# Altium project IN-14辉光钟.PrjPcb
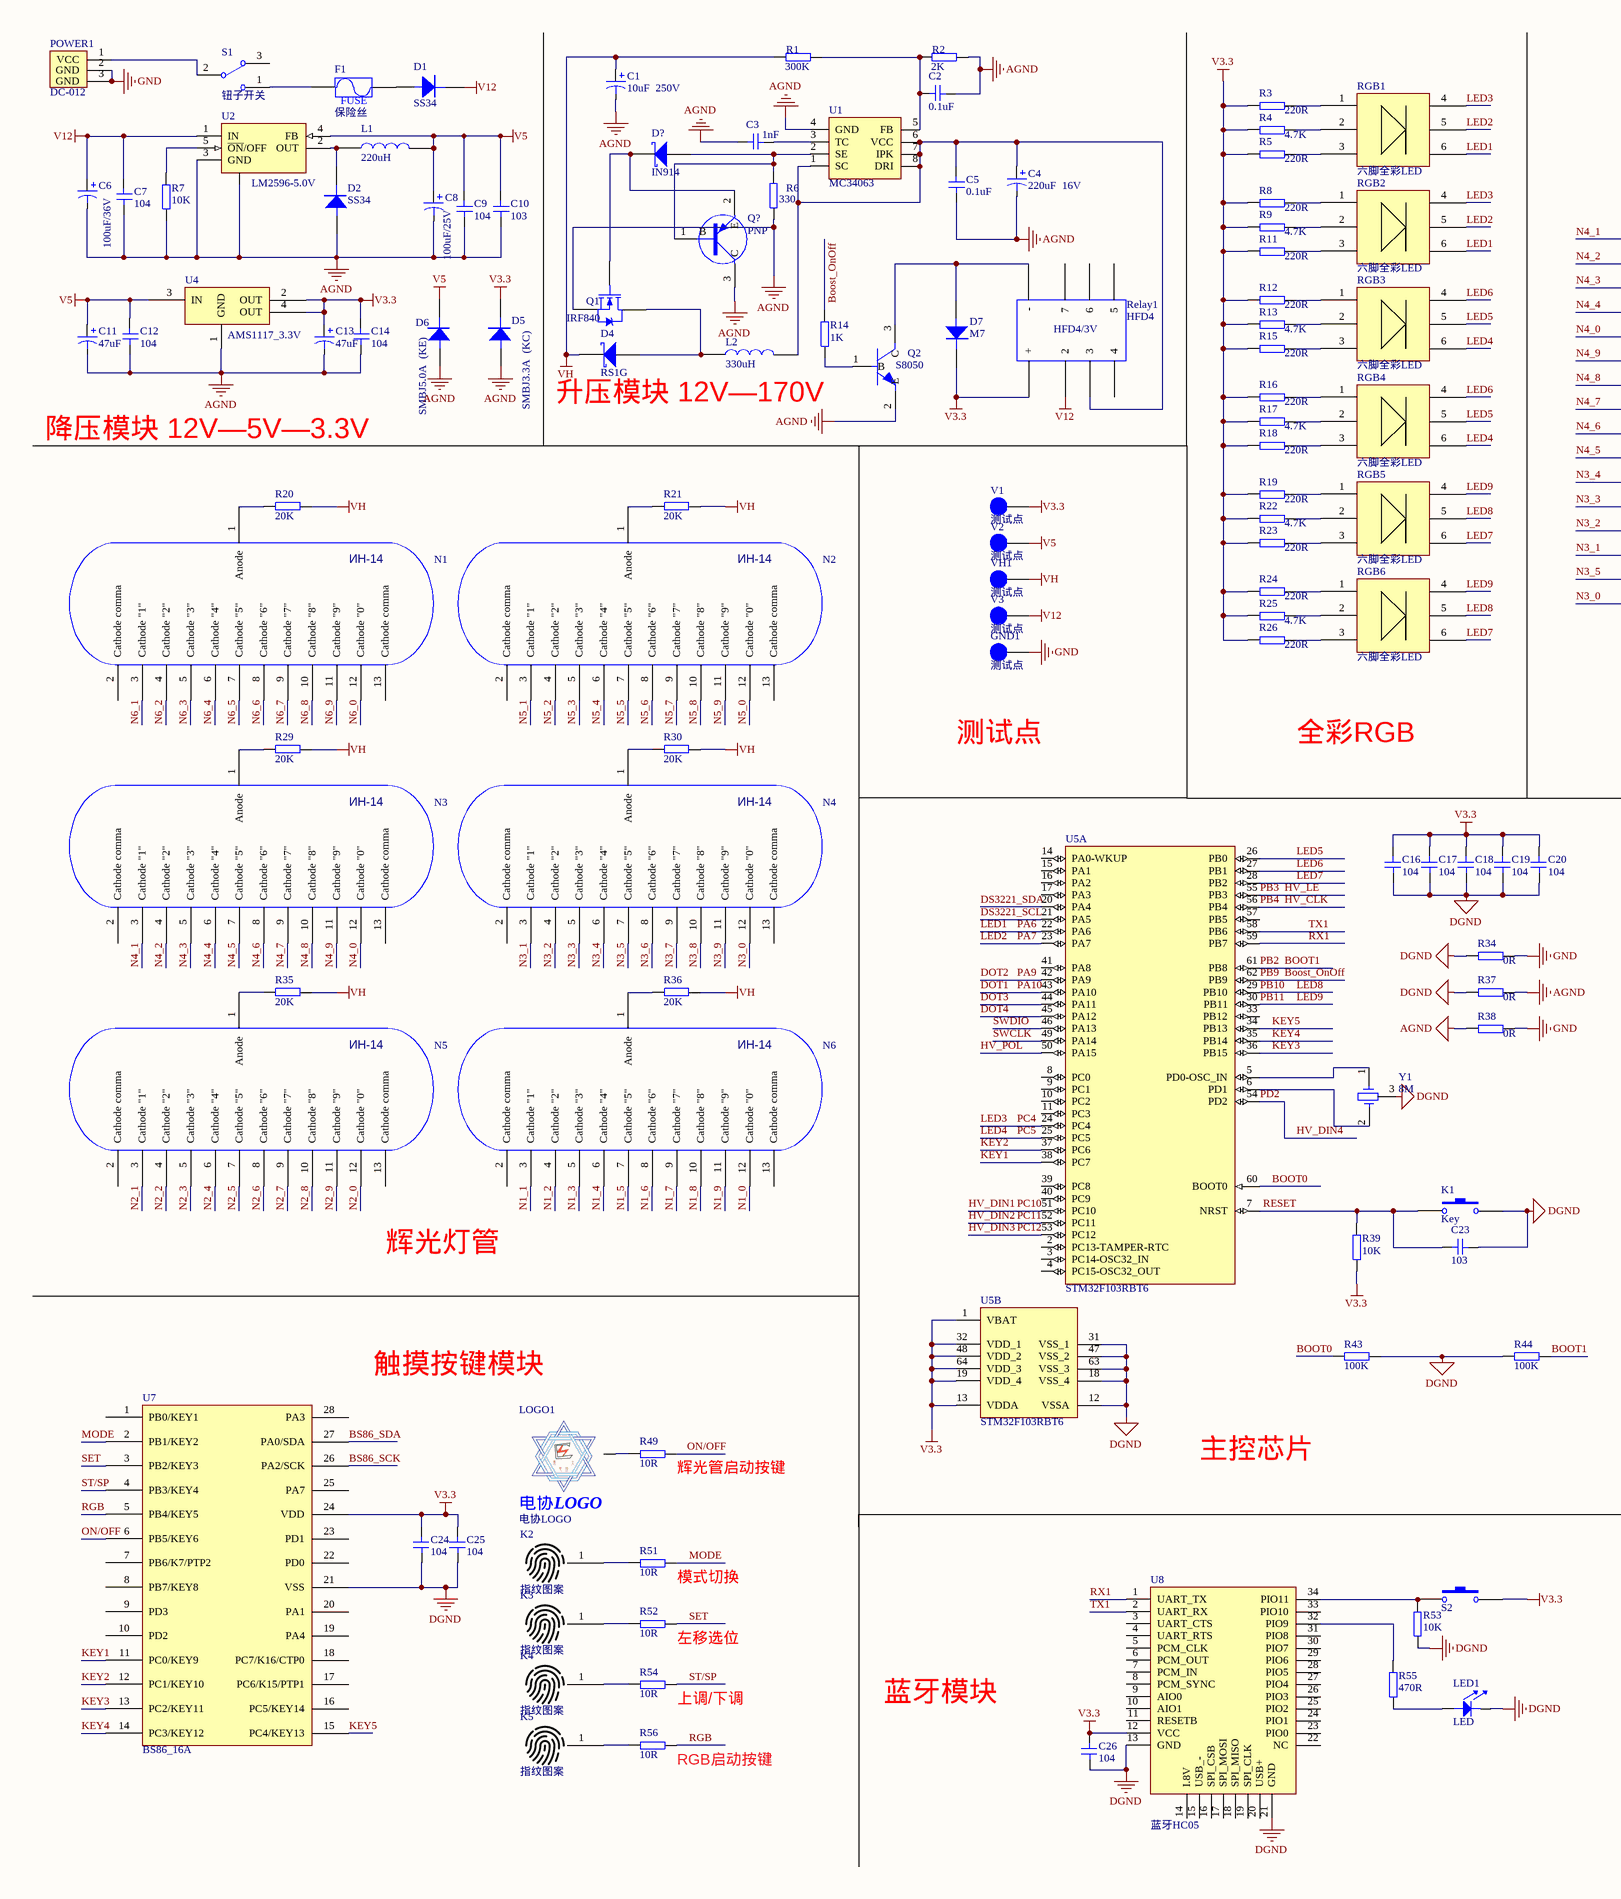
[diagram p0: IN-14辉光钟_Sheet.SchDoc, left]
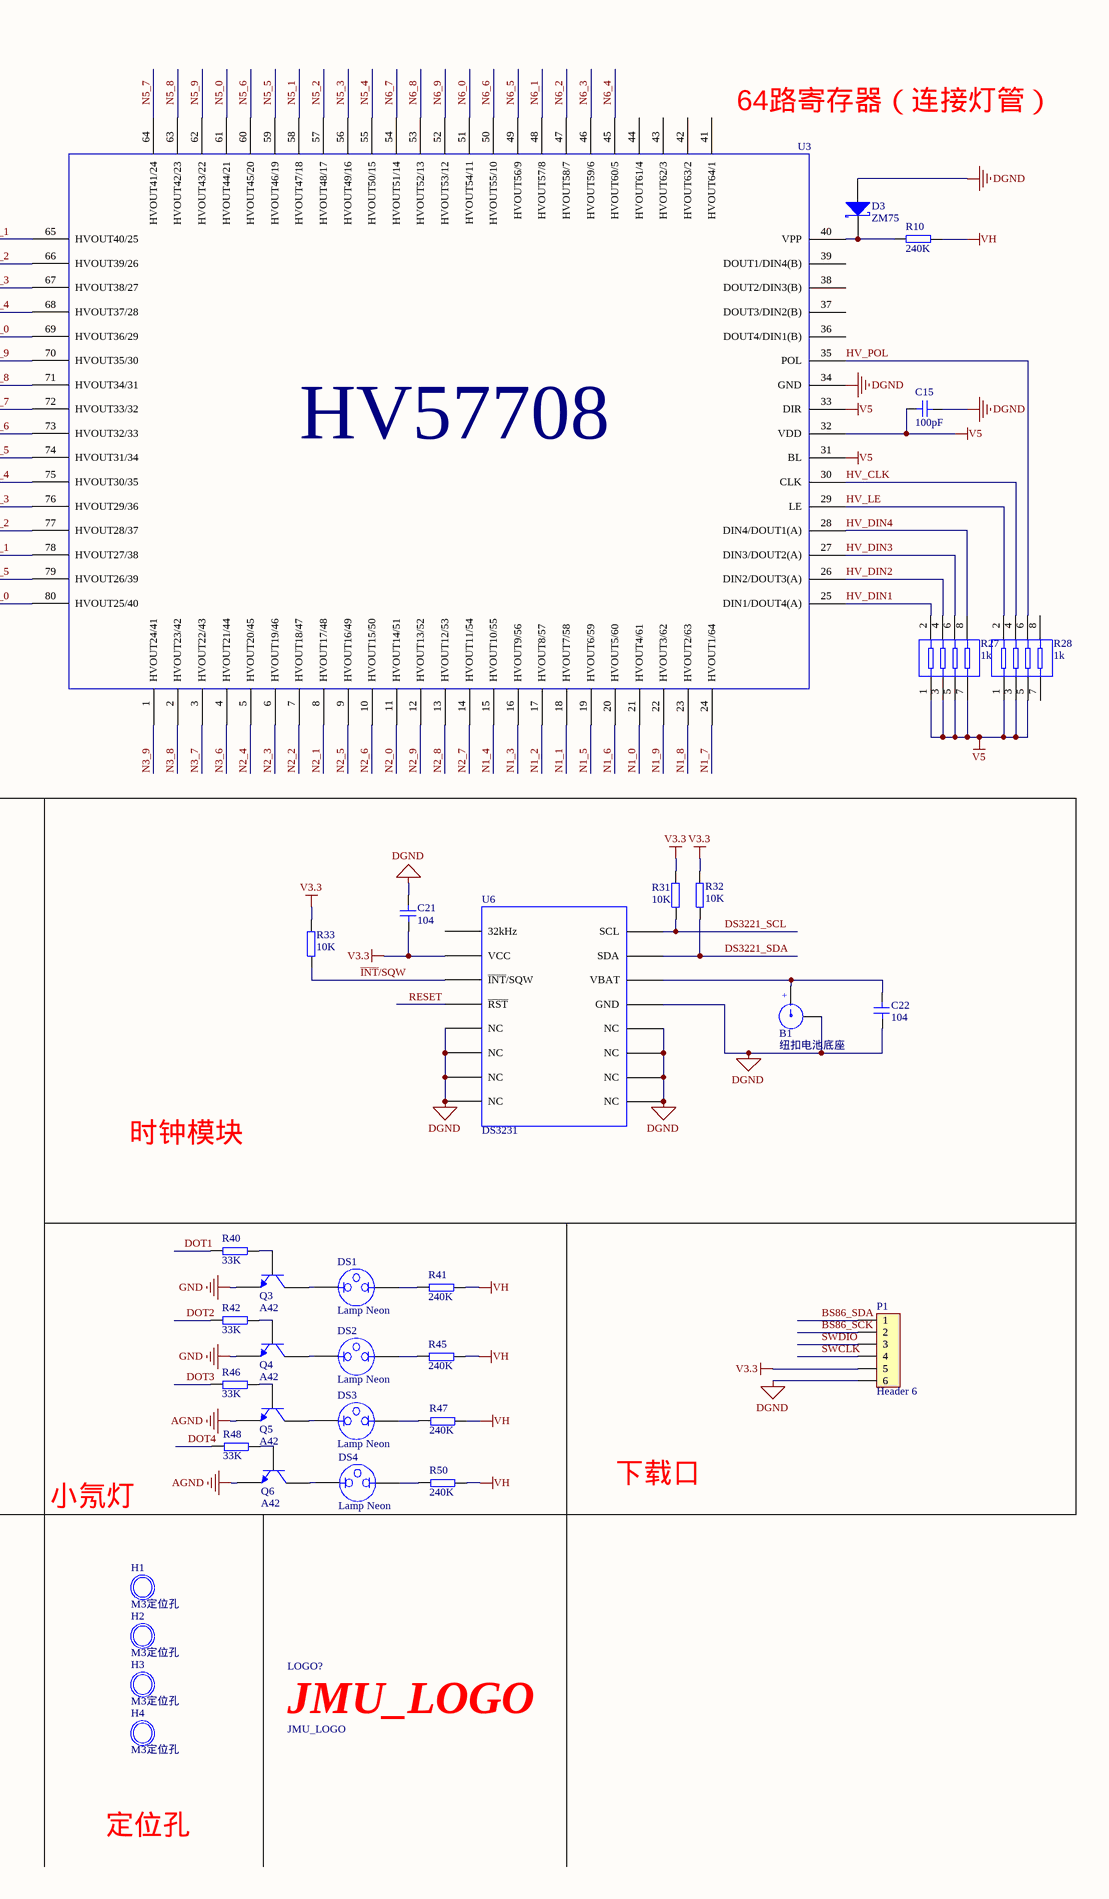
[diagram p1: IN-14辉光钟_Sheet.SchDoc, right]
1 sheet, 148 parts. Net scope: global (net labels, ports and power ports of the same name join across sheets).
Board file: IN-14辉光钟_PCB.PcbDoc

## Sheet IN-14辉光钟_Sheet.SchDoc
size A2

### Parts
B1  纽扣电池底座  [CR1220]
C1  10uF  250V  [RB.2.4]
C2  0.1uF  [0805C]
C3  1nF  [0805C]
C4  220uF  16V  [RB.1.2]
C5  0.1uF  [0805C]
C6  100uF/36V  [TAJ-D]
C7  104  [0805C]
C8  100uF/25V  [TAJ-D]
C9  104  [0805C]
C10  103  [0805C]
C11  47uF  [TAJ-A]
C12  104  [0805C]
C13  47uF  [TAJ-A]
C14  104  [0805C]
C15  100pF  [0805C]
C16  104  [0805C]
C17  104  [0805C]
C18  104  [0805C]
C19  104  [0805C]
C20  104  [0805C]
C21  104  [0805C]
C22  104  [0805C]
C23  103  [0805C]
C24  104  [0805C]
C25  104  [0805C]
C26  104  [0805C]
D1  SS34  [SMA/DO-214AC]
D2  SS34  [SMA/DO-214AC]
D3  ZM75  [LL-34]
D4  RS1G  [SMB]
D5  SMBJ3.3A  (KC)  [SMBJ]
D6  SMBJ5.0A  (KE)  [SMBJ]
D7  M7  [SMA/DO-214AC]
D?  IN914  [LL-34]
DS1  Lamp Neon  [PIN2]
DS2  Lamp Neon  [PIN2]
DS3  Lamp Neon  [PIN2]
DS4  Lamp Neon  [PIN2]
F1  保险丝  [1812]
GND1  测试点  [HEADER 1]
H1  M3定位孔  [定位孔]
H2  M3定位孔  [定位孔]
H3  M3定位孔  [定位孔]
H4  M3定位孔  [定位孔]
K1  Key  [贴片按键]
K2  指纹图案  [指纹图案]
K3  指纹图案  [指纹图案]
K4  指纹图案  [指纹图案]
K5  指纹图案  [指纹图案]
L1  220uH  [电感 220uh]
L2  330uH  [电感 220uH(大)]
LED1  LED  [0805LED(RED)]
LOGO1  电协LOGO  [电协LOGO]
LOGO?  JMU_LOGO  [JMU_LOGO(1.35cm)]
N1  ИН-14  [IN14]  (value not drawn)
N2  ИН-14  [IN14]  (value not drawn)
N3  ИН-14  [IN14]  (value not drawn)
N4  ИН-14  [IN14]  (value not drawn)
N5  ИН-14  [IN14]  (value not drawn)
N6  ИН-14  [IN14]  (value not drawn)
P1  Header 6  [Header 6]
POWER1  DC-012  [DC-005]
Q1  IRF840  [TO-263-2L]
Q2  S8050  [SOT-23]
Q3  A42  [SOT-23-3L]
Q4  A42  [SOT-23-3L]
Q5  A42  [SOT-23-3L]
Q6  A42  [SOT-23-3L]
Q?  PNP  [TO-92]
R1  300K  [0805R]
R2  2K  [0805R]
R3  220R  [0805R]
R4  4.7K  [0805R]
R5  220R  [0805R]
R6  330  [0805R]
R7  10K  [0805R]
R8  220R  [0805R]
R9  4.7K  [0805R]
R10  240K  [0805R]
R11  220R  [0805R]
R12  220R  [0805R]
R13  4.7K  [0805R]
R14  1K  [0805R]
R15  220R  [0805R]
R16  220R  [0805R]
R17  4.7K  [0805R]
R18  220R  [0805R]
R19  220R  [0805R]
R20  20K  [0805R]
R21  20K  [0805R]
R22  4.7K  [0805R]
R23  220R  [0805R]
R24  220R  [0805R]
R25  4.7K  [0805R]
R26  220R  [0805R]
R27  1k  [排阻(4位贴片)]
R28  1k  [排阻(4位贴片)]
R29  20K  [0805R]
R30  20K  [0805R]
R31  10K  [0805R]
R32  10K  [0805R]
R33  10K  [0805R]
R34  0R  [0805R]
R35  20K  [0805R]
R36  20K  [0805R]
R37  0R  [0805R]
R38  0R  [0805R]
R39  10K  [0805R]
R40  33K  [0805R]
R41  240K  [0805R]
R42  33K  [0805R]
R43  100K  [0805R]
R44  100K  [0805R]
R45  240K  [0805R]
R46  33K  [0805R]
R47  240K  [0805R]
R48  33K  [0805R]
R49  10R  [0805R]
R50  240K  [0805R]
R51  10R  [0805R]
R52  10R  [0805R]
R53  10K  [0805R]
R54  10R  [0805R]
R55  470R  [0805R]
R56  10R  [0805R]
Relay1  HFD4  [HFD4]
RGB1  六脚全彩LED  [全彩LED]
RGB2  六脚全彩LED  [全彩LED]
RGB3  六脚全彩LED  [全彩LED]
RGB4  六脚全彩LED  [全彩LED]
RGB5  六脚全彩LED  [全彩LED]
RGB6  六脚全彩LED  [全彩LED]
S1  钮子开关  [钮子开关（大）]
S2  SW-PB  [贴片按键（红头）]  (value not drawn)
U1  MC34063  [SOW-8]
U2  LM2596-5.0V  [TO-263-5]
U3  HV57708  [HV57708PG]  (value not drawn)
U4  AMS1117_3.3V  [SOT-223]
U5  STM32F103RBT6  [LQFP64_N]  (parts A,B of 2)
U6  DS3231  [SOP16_75MM]
U7  BS86_16A  [LC-SOP-28_300mil]
U8  蓝牙HC05  [蓝牙HC05]
V1  测试点  [HEADER 1]
V2  测试点  [HEADER 1]
V3  测试点  [HEADER 1]
VH1  测试点  [HEADER 1]
Y1  8M  [三脚贴片8M晶振]

### Nets
AGND: C1.2 C2.1 C3.2 C4.2 C5.1 C6.2 C7.1 C8.2 C9.1 C10.1 C11.2 C12.1 C13.2 C14.1 D2.1 D5.1 D6.1 Q1.3(S) Q2.2(E) Q5.2(E) Q6.2(E) Q?.3(C) R2.2 R6.1 R7.1 R37.2 R38.1 U1.4(GND) U2.3(GND) U2.6 U4.1(GND)
DGND: B1.2 C15.1 C16.2 C17.2 C18.2 C19.2 C20.2 C21.1 C22.2 C23.1 C24.2 C25.2 C26.2 D3.1(A) K1.2 LED1.2 P1.6 R34.1 R37.1 R43.1 R44.2 R53.1 U3.34(GND) U5.12(VSSA) U5.18(VSS_4) U5.31(VSS_1) U5.47(VSS_2) U5.63(VSS_3) U6.5(NC) U6.6(NC) U6.7(NC) U6.8(NC) U6.9(NC) U6.10(NC) U6.11(NC) U6.12(NC) U6.13(GND) U7.21(VSS) U8.13(GND) U8.21(GND) Y1.3
GND: GND1.1 POWER1.2(GND) POWER1.3(GND) Q3.2(E) Q4.2(E) R34.2 R38.2
V3.3: C13.1 C14.2 C16.1 C17.1 C18.1 C19.1 C20.1 C21.2 C24.1 C25.1 C26.1 D5.2 D7.2 P1.5 R3.1 R4.1 R5.1 R8.1 R9.1 R11.1 R12.1 R13.1 R15.1 R16.1 R17.1 R18.1 R19.1 R22.1 R23.1 R24.1 R25.1 R26.1 R31.2 R32.2 R33.2 R39.1 Relay1.1(+) S2.2 U4.2(OUT) U4.4(OUT) U5.1(VBAT) U5.13(VDDA) U5.19(VDD_4) U5.32(VDD_1) U5.48(VDD_2) U5.64(VDD_3) U6.2(VCC) U7.24(VDD) U8.12(VCC) V1.1
V5: C8.1 C9.2 C10.2 C11.1 C12.2 C15.2 D6.2 L1.2 R27.1 R27.3 R27.5 R27.7 R28.1 R28.3 R28.5 U2.4(FB) U3.31(BL) U3.32(VDD) U3.33(DIR) U4.3(IN) V2.1
V12: C6.1 C7.2 D1.2 Relay1.2 U2.1(IN) V3.1
VH: C1.1 D4.2(K) R1.1 R10.1 R20.1 R21.1 R29.1 R30.1 R35.1 R36.1 R41.2 R45.2 R47.2 R50.2 VH1.1
Boost_OnOff: R14.2 U5.62(PB9)  [also labelled PB9]
BOOT0: R43.2 U5.60(BOOT0)
BOOT1: R44.1 U5.61(PB8)  [also labelled PB2]
BS86_SCK: P1.2 U7.26(PA2/SCK)
BS86_SDA: P1.1 U7.27(PA0/SDA)
DOT1: R40.1 U5.43(PA10)  [also labelled PA10]
DOT2: R42.1 U5.42(PA9)  [also labelled PA9]
DOT3: R46.1 U5.44(PA11)
DOT4: R48.1 U5.45(PA12)
DS3221_SCL: R31.1 U5.21(PA5) U6.16(SCL)
DS3221_SDA: R32.1 U5.20(PA4) U6.15(SDA)
HV_CLK: R28.4 U3.30(CLK) U5.56(PB4)  [also labelled PB4]
HV_DIN1: R27.2 U3.25(DIN1/DOUT4(A)) U5.51(PC10)  [also labelled PC10]
HV_DIN2: R27.4 U3.26(DIN2/DOUT3(A)) U5.52(PC11)  [also labelled PC11]
HV_DIN3: R27.6 U3.27(DIN3/DOUT2(A)) U5.53(PC12)  [also labelled PC12]
HV_DIN4: R27.8 U3.28(DIN4/DOUT1(A)) U5.54(PD2)  [also labelled PD2]
HV_LE: R28.2 U3.29(LE) U5.55(PB3)  [also labelled PB3]
HV_POL: R28.6 U3.35(POL) U5.50(PA15)
~{INT}/SQW: R33.1 U6.3(~{INT}/SQW)
KEY1: U5.38(PC7) U7.11(PC0/KEY9)
KEY2: U5.37(PC6) U7.12(PC1/KEY10)
KEY3: U5.36(PB15) U7.13(PC2/KEY11)
KEY4: U5.35(PB14) U7.14(PC3/KEY12)
KEY5: U5.34(PB13) U7.15(PC4/KEY13)
LED1: RGB1.6 RGB2.6 U5.22(PA6)  [also labelled PA6]
LED2: RGB1.5 RGB2.5 U5.23(PA7)  [also labelled PA7]
LED3: RGB1.4 RGB2.4 U5.24(PC4)  [also labelled PC4]
LED4: RGB3.6 RGB4.6 U5.25(PC5)  [also labelled PC5]
LED5: RGB3.5 RGB4.5 U5.26(PB0)
LED6: RGB3.4 RGB4.4 U5.27(PB1)
LED7: RGB5.6 RGB6.6 U5.28(PB2)
LED8: RGB5.5 RGB6.5 U5.29(PB10)  [also labelled PB10]
LED9: RGB5.4 RGB6.4 U5.30(PB11)  [also labelled PB11]
MODE: R51.2 U7.2(PB1/KEY2)
N1_0: N6.12(Cathode_"0") U3.21(HVOUT4/61)
N1_1: N6.3(Cathode_"1") U3.18(HVOUT7/58)
N1_2: N6.4(Cathode_"2") U3.17(HVOUT8/57)
N1_3: N6.5(Cathode_"3") U3.16(HVOUT9/56)
N1_4: N6.6(Cathode_"4") U3.15(HVOUT10/55)
N1_5: N6.7(Cathode_"5") U3.19(HVOUT6/59)
N1_6: N6.8(Cathode_"6") U3.20(HVOUT5/60)
N1_7: N6.9(Cathode_"7") U3.24(HVOUT1/64)
N1_8: N6.10(Cathode_"8") U3.23(HVOUT2/63)
N1_9: N6.11(Cathode_"9") U3.22(HVOUT3/62)
N2_0: N5.12(Cathode_"0") U3.11(HVOUT14/51)
N2_1: N5.3(Cathode_"1") U3.8(HVOUT17/48)
N2_2: N5.4(Cathode_"2") U3.7(HVOUT18/47)
N2_3: N5.5(Cathode_"3") U3.6(HVOUT19/46)
N2_4: N5.6(Cathode_"4") U3.5(HVOUT20/45)
N2_5: N5.7(Cathode_"5") U3.9(HVOUT16/49)
N2_6: N5.8(Cathode_"6") U3.10(HVOUT15/50)
N2_7: N5.9(Cathode_"7") U3.14(HVOUT11/54)
N2_8: N5.10(Cathode_"8") U3.13(HVOUT12/53)
N2_9: N5.11(Cathode_"9") U3.12(HVOUT13/52)
N3_0: N4.12(Cathode_"0") U3.80(HVOUT25/40)
N3_1: N4.3(Cathode_"1") U3.78(HVOUT27/38)
N3_2: N4.4(Cathode_"2") U3.77(HVOUT28/37)
N3_3: N4.5(Cathode_"3") U3.76(HVOUT29/36)
N3_4: N4.6(Cathode_"4") U3.75(HVOUT30/35)
N3_5: N4.7(Cathode_"5") U3.79(HVOUT26/39)
N3_6: N4.8(Cathode_"6") U3.4(HVOUT21/44)
N3_7: N4.9(Cathode_"7") U3.3(HVOUT22/43)
N3_8: N4.10(Cathode_"8") U3.2(HVOUT23/42)
N3_9: N4.11(Cathode_"9") U3.1(HVOUT24/41)
N4_0: N3.12(Cathode_"0") U3.69(HVOUT36/29)
N4_1: N3.3(Cathode_"1") U3.65(HVOUT40/25)
N4_2: N3.4(Cathode_"2") U3.66(HVOUT39/26)
N4_3: N3.5(Cathode_"3") U3.67(HVOUT38/27)
N4_4: N3.6(Cathode_"4") U3.68(HVOUT37/28)
N4_5: N3.7(Cathode_"5") U3.74(HVOUT31/34)
N4_6: N3.8(Cathode_"6") U3.73(HVOUT32/33)
N4_7: N3.9(Cathode_"7") U3.72(HVOUT33/32)
N4_8: N3.10(Cathode_"8") U3.71(HVOUT34/31)
N4_9: N3.11(Cathode_"9") U3.70(HVOUT35/30)
N5_0: N2.12(Cathode_"0") U3.61(HVOUT44/21)
N5_1: N2.3(Cathode_"1") U3.58(HVOUT47/18)
N5_2: N2.4(Cathode_"2") U3.57(HVOUT48/17)
N5_3: N2.5(Cathode_"3") U3.56(HVOUT49/16)
N5_4: N2.6(Cathode_"4") U3.55(HVOUT50/15)
N5_5: N2.7(Cathode_"5") U3.59(HVOUT46/19)
N5_6: N2.8(Cathode_"6") U3.60(HVOUT45/20)
N5_7: N2.9(Cathode_"7") U3.64(HVOUT41/24)
N5_8: N2.10(Cathode_"8") U3.63(HVOUT42/23)
N5_9: N2.11(Cathode_"9") U3.62(HVOUT43/22)
N6_0: N1.12(Cathode_"0") U3.51(HVOUT54/11)
N6_1: N1.3(Cathode_"1") U3.48(HVOUT57/8)
N6_2: N1.4(Cathode_"2") U3.47(HVOUT58/7)
N6_3: N1.5(Cathode_"3") U3.46(HVOUT59/6)
N6_4: N1.6(Cathode_"4") U3.45(HVOUT60/5)
N6_5: N1.7(Cathode_"5") U3.49(HVOUT56/9)
N6_6: N1.8(Cathode_"6") U3.50(HVOUT55/10)
N6_7: N1.9(Cathode_"7") U3.54(HVOUT51/14)
N6_8: N1.10(Cathode_"8") U3.53(HVOUT52/13)
N6_9: N1.11(Cathode_"9") U3.52(HVOUT53/12)
ON/OFF: R49.2 U7.6(PB5/KEY6)
RESET: C23.2 K1.1 R39.2 U5.7(NRST) U6.4(~{RST})
RGB: R56.2 U7.5(PB4/KEY5)
RX1: U5.59(PB7) U8.1(UART_TX)
SET: R52.2 U7.3(PB2/KEY3)
ST/SP: R54.2 U7.4(PB3/KEY4)
SWCLK: P1.4 U5.49(PA14)
SWDIO: P1.3 U5.46(PA13)
TX1: U5.58(PB6) U8.2(UART_RX)
NetB1_1: B1.1(+) C22.1 U6.14(VBAT)
NetC2_2: C2.2 R1.2 R2.1 U1.5(FB)
NetC3_1: C3.1 U1.3(TC)
NetC4_1: C4.1 C5.2 L2.2 Relay1.3 U1.1(SC) U1.6(VCC) U1.7(IPK) U1.8(DRI)
NetD1_1: D1.1 F1.2
NetD2_2: D2.2 L1.1 U2.2(OUT)
NetD3_2: D3.2(K) R10.2 U3.40(VPP)
NetD4_1: D4.1(A) L2.1 Q1.2(D)
NetD7_1: D7.1 Q2.3(C) Relay1.8(-)
NetD?_1: D?.1(A) Q?.1(B) R6.2 U1.2(SE)
NetD?_2: D?.2(K) Q1.1(G) Q?.2(E)
NetDS1_1: DS1.1 Q3.3(C)
NetDS1_2: DS1.2 R41.1
NetDS2_1: DS2.1 Q4.3(C)
NetDS2_2: DS2.2 R45.1
NetDS3_1: DS3.1 Q5.3(C)
NetDS3_2: DS3.2 R47.1
NetDS4_1: DS4.1 Q6.3(C)
NetDS4_2: DS4.2 R50.1
NetF1_1: F1.1 S1.1
NetK2_1: K2.1 R51.1
NetK3_1: K3.1 R52.1
NetK4_1: K4.1 R54.1
NetK5_1: K5.1 R56.1
NetLED1_1: LED1.1 R55.1
NetLOGO1_1: LOGO1.1 R49.1
NetN1_1: N1.1(Anode) R20.2
NetN2_1: N2.1(Anode) R21.2
NetN3_1: N3.1(Anode) R29.2
NetN4_1: N4.1(Anode) R30.2
NetN5_1: N5.1(Anode) R35.2
NetN6_1: N6.1(Anode) R36.2
NetPOWER1_1: POWER1.1(VCC) S1.2
NetQ2_1: Q2.1(B) R14.1
NetQ3_1: Q3.1(B) R40.2
NetQ4_1: Q4.1(B) R42.2
NetQ5_1: Q5.1(B) R46.2
NetQ6_1: Q6.1(B) R48.2
NetR3_2: R3.2 RGB1.1
NetR4_2: R4.2 RGB1.2
NetR5_2: R5.2 RGB1.3
NetR7_2: R7.2 U2.5(~{ON}/OFF)
NetR8_2: R8.2 RGB2.1
NetR9_2: R9.2 RGB2.2
NetR11_2: R11.2 RGB2.3
NetR12_2: R12.2 RGB3.1
NetR13_2: R13.2 RGB3.2
NetR15_2: R15.2 RGB3.3
NetR16_2: R16.2 RGB4.1
NetR17_2: R17.2 RGB4.2
NetR18_2: R18.2 RGB4.3
NetR19_2: R19.2 RGB5.1
NetR22_2: R22.2 RGB5.2
NetR23_2: R23.2 RGB5.3
NetR24_2: R24.2 RGB6.1
NetR25_2: R25.2 RGB6.2
NetR26_2: R26.2 RGB6.3
NetR53_2: R53.2 S2.1 U8.34(PIO11)
NetR55_2: R55.2 U8.32(PIO9)
NetU5_5: U5.5(PD0-OSC_IN) Y1.1
NetU5_6: U5.6(PD1) Y1.2

Not connected (* = marked no-connect by the designer): N1 2(Cathode_comma) 13(Cathode_comma); N2 2(Cathode_comma) 13(Cathode_comma); N3 2(Cathode_comma) 13(Cathode_comma); N4 2(Cathode_comma) 13(Cathode_comma); N5 2(Cathode_comma) 13(Cathode_comma); N6 2(Cathode_comma) 13(Cathode_comma); R28 7 8; Relay1 4 5 6 7; S1 3; U3 36(DOUT4/DIN1(B)) 37(DOUT3/DIN2(B)) 38(DOUT2/DIN3(B)) 39(DOUT1/DIN4(B)) 41(HVOUT64/1) 42(HVOUT63/2) 43(HVOUT62/3) 44(HVOUT61/4); U5 2(PC13-TAMPER-RTC) 3(PC14-OSC32_IN) 4(PC15-OSC32_OUT) 8(PC0) 9(PC1) 10(PC2) 11(PC3) 14(PA0-WKUP) 15(PA1) 16(PA2) 17(PA3) 33(PB12) 39(PC8) 40(PC9) 41(PA8) 57(PB5); U6 1(32kHz); U7 1(PB0/KEY1) 7(PB6/K7/PTP2) 8(PB7/KEY8) 9(PD3) 10(PD2) 16(PC5/KEY14) 17(PC6/K15/PTP1) 18(PC7/K16/CTP0) 19(PA4) 20(PA1) 22(PD0) 23(PD1) 25(PA7) 28(PA3); U8 3(UART_CTS) 4(UART_RTS) 5(PCM_CLK) 6(PCM_OUT) 7(PCM_IN) 8(PCM_SYNC) 9(AIO0) 10(AIO1) 11(RESETB) 14(I.8V) 15(USB_-) 16(SPI_CSB) 17(SPI_MOSI) 18(SPI_MISO) 19(SPI_CLK) 20(USB+) 22(NC) 23(PIO0) 24(PIO1) 25(PIO2) 26(PIO3) 27(PIO4) 28(PIO5) 29(PIO6) 30(PIO7) 31(PIO8) 33(PIO10)

### Notes on the sheet
- (near U3) 64路寄存器（连接灯管）
- 升压模块 12V—170V
- 降压模块 12V—5V—3.3V
- 测试点
- 全彩RGB
- 时钟模块
- 辉光灯管
- 触摸按键模块
- (near R49) 辉光管启动按键
- 主控芯片
- 下载口
- 小氖灯
- (near R51) 模式切换
- (near R52) 左移选位
- (near R54) 上调/下调
- 蓝牙模块
- (near R56) RGB启动按键
- 定位孔
- (in symbol Fuse) FUSE
- (in symbol Relay) HFD4/3V

### Library data of the parts
C1 C4 = Cap3: 直插极性电容
C2 C3 C5 C7 C9 C10 C12 C14-C26 = Cap1: 无极贴片电容
C6 C8 C11 C13 = Pol Cap: 极性贴片电容
D1 D2 D5-D7 = Diode: 二极管
D3 D? = Diode 11DQ03: Schottky Rectifier; Published: 8-Jun-2000; LatestRevisionDate: 17-Jul-2002; LatestRevisionNote: Re-released for DXP Platform.; DatasheetVersion: Dec-1997; PackageReference: DO-204AL; Publisher: Altium Limited; PackageDescription: Diode, Axial; Body 5.2 x 2.7 mm (LxDia. max), Lead Dia. 0.86 mm (max); Code_JEDEC: DO-204-AL; ComponentLink1Description: Manufacturer Link; ComponentLink1URL: http://www.irf.com/; ComponentLink2Description: Datasheet; ComponentLink2URL: http://www.irf.com/product-info/datasheets/data/11dq03.pdf
D4 = D Schottky: Schottky Diode; Published: 8-Jun-2000; LatestRevisionDate: 17-Jul-2002; LatestRevisionNote: Re-released for DXP Platform.; PackageReference: SMB; Publisher: Altium Limited; PackageDescription: DO-214-AA/SMB; 2 C-Bend Leads; Body 5.3 x 3.6 mm, inc. leads (LxW); Code_JEDEC: DO-214-AA
DS1-DS4 = Lamp Neon: Neon Lamp; Published: 24-Mar-1999; LatestRevisionDate: 17-Jul-2002; LatestRevisionNote: Re-released for DXP Platform.; PackageReference: PIN2; Publisher: Altium Limited
F1 = Fuse
K1 = 轻触按键: 轻触开关
L1 L2 = L: 电感
LED1 = LED: 发光二极管
LOGO? = JMU_LOGO: LOGO
P1 = Header 6: 排针
POWER1 = DC-005: 电源插孔
Q1 = NMOS-2: N-Channel Power MOSFET; Note: Pin 2 is electrically connected to pin 4.; Published: 8-Jun-2000; LatestRevisionDate: 17-Jul-2002; LatestRevisionNote: Re-released for DXP Platform.; DatasheetVersion: PD-9.814; PackageVersion: Feb-1997; PackageReference: TO-220AB; Publisher: Altium Limited; PackageDescription: TO, Thru-Hole, Vertical, Heatsink Mounted; 3 In-Line Leads; Pitch 2.54 mm; ComponentLink1Description: Manufacturer Link; ComponentLink1URL: http://www.irf.com/
Q2 = NPN: NPN三极管
Q3-Q6 = NPN: NPN Bipolar Transistor; Published: 8-Jun-2000; LatestRevisionDate: 17-Jul-2002; LatestRevisionNote: Re-released for DXP Platform.; PackageReference: TO-226; Publisher: Altium Limited; Code_JEDEC: TO-226-AA
Q? = PNP: PNP三极管
R1-R26 R29-R56 = Res: 电阻
R27 R28 = Res-4: 排阻
Relay1 = Relay
S1 = 钮子开关: 大功率开关
S2 = SW-PB: Switch; Published: 24-Mar-1999; LatestRevisionDate: 17-Jul-2002; LatestRevisionNote: Re-released for DXP Platform.; PackageReference: SPST-2; Publisher: Altium Limited
U1 = MC34063: 12V电源芯片
U2 = LM2596: 5V电源芯片
U4 = AMS1117-3.3V/5.0V: 电源芯片
U5 = STM32F103RBT6: STM32 ARM-based 32-bit MCU Performance Line with 128 kB Flash, 20 kB Internal RAM, -40 to +85癈 Temperature, 64-Pin LQFP, Tray; DatasheetVersion: rev13.0, Apr-2011; PackageVersion: rev13, Apr-2011; PackageReference: LQFP64; PackageDescription: 64-Pin Low-Profile Quad Flat Pack, 10 x 10 mm Body, 0.5 mm Pitch (LQFP64); ComponentLink1Description: Manufacturer URL; ComponentLink1URL: http://www.st.com/; ComponentLink2Description: STM32F103 Datasheet; ComponentLink2URL: http://www.st.com/internet/com/TECHNICAL_RESOURCES/TECHNICAL_LITERATURE/DATASHEET/CD00161566.pdf; ComponentLink3Description: STM32 Family Web Page; ComponentLink3URL: www.st.com/stm32
Y1 = XTAL三脚贴片晶振